# EAGLE design AUTOPILOT IO (EAGLE 7.7.0)
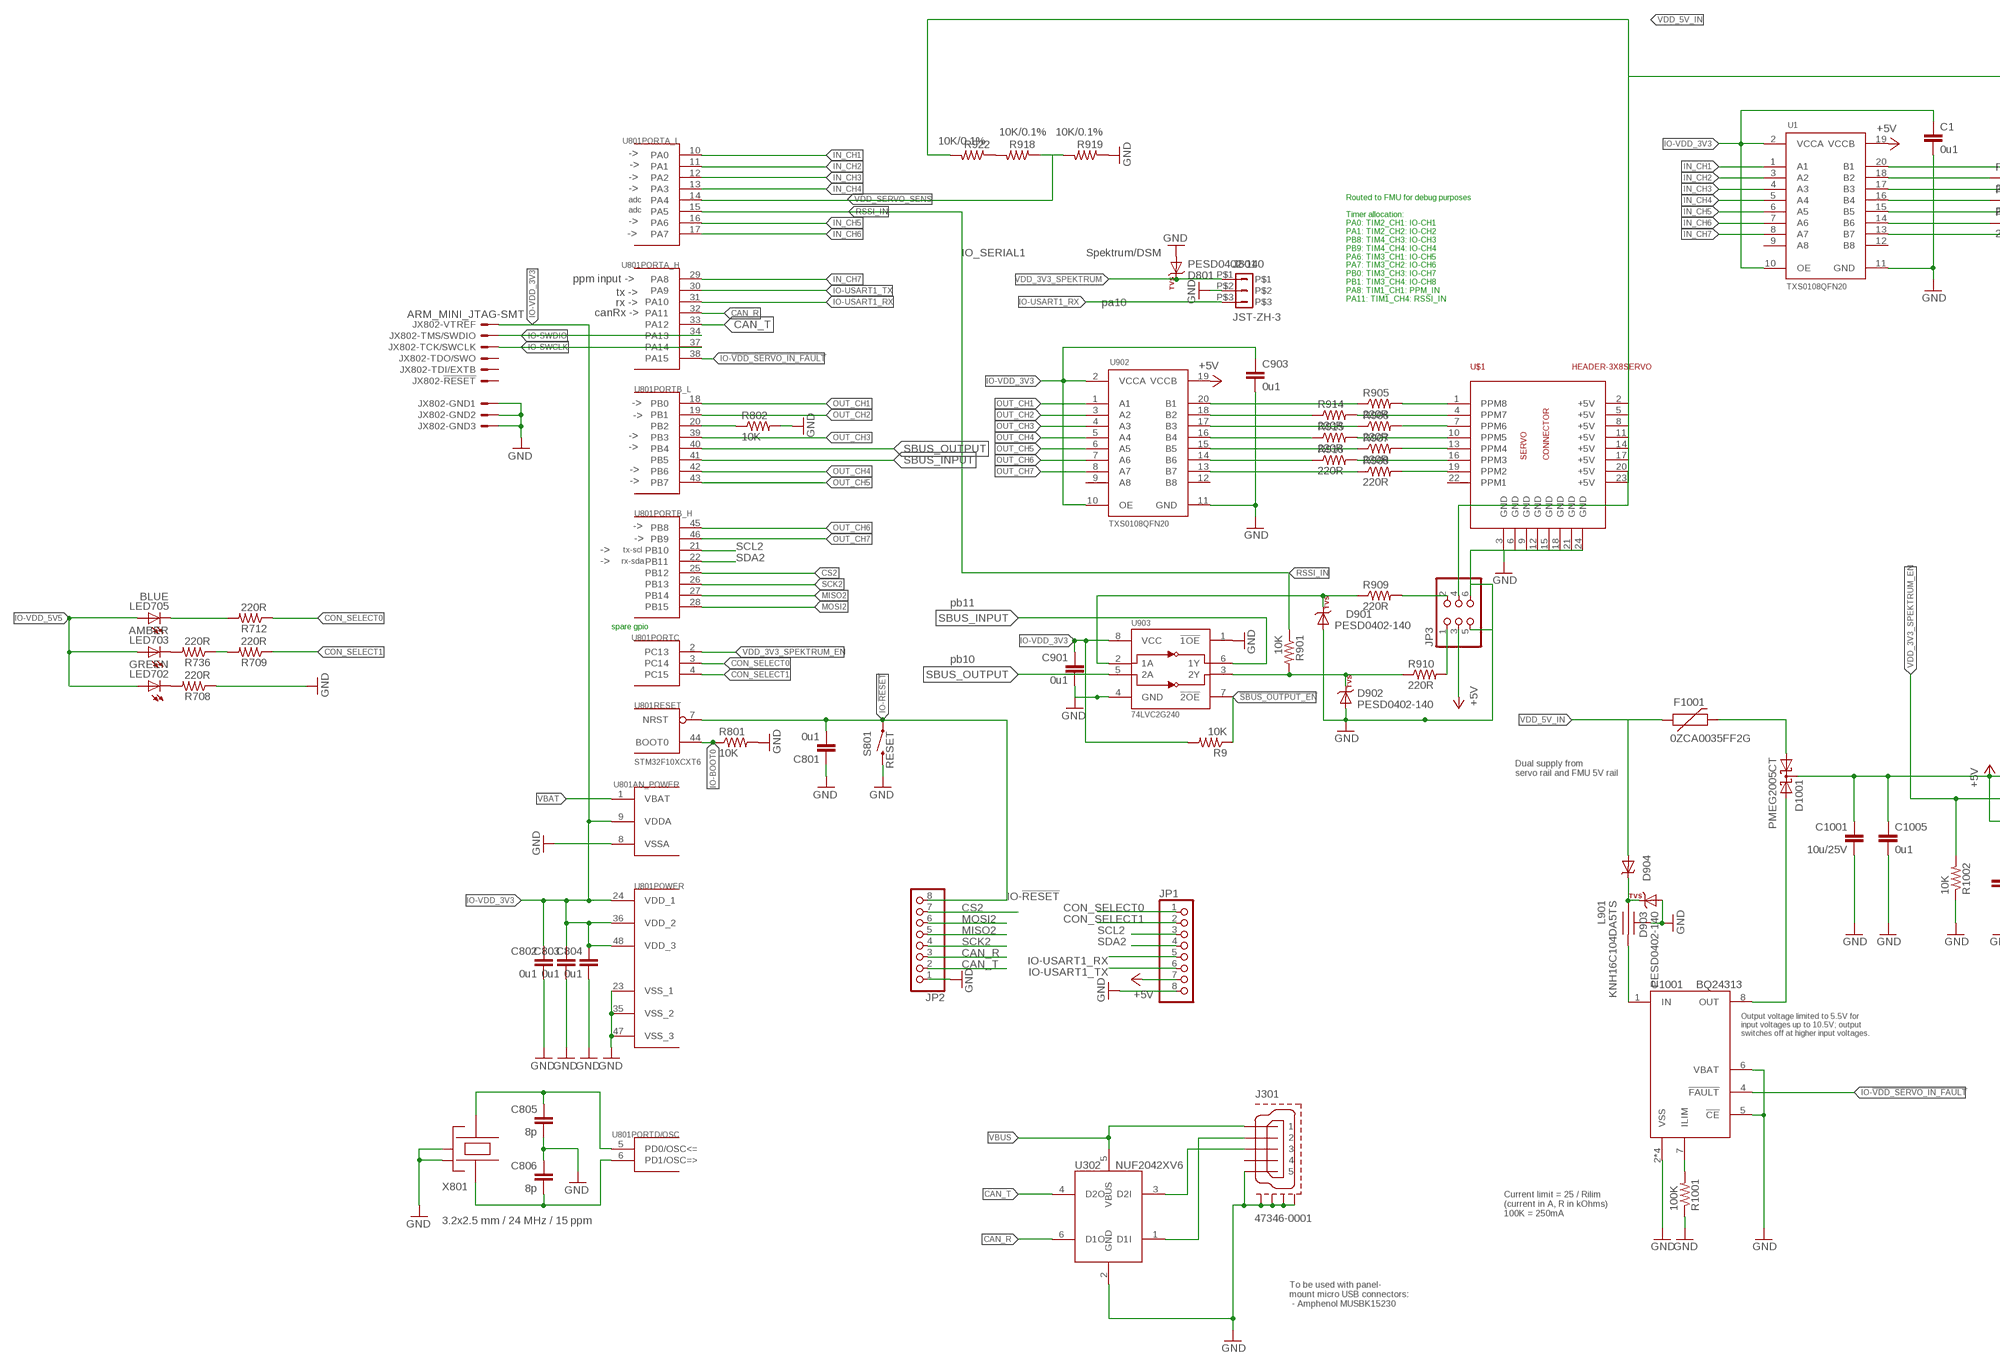
[diagram p0: schematic, sheet 1, part 1 of 2]
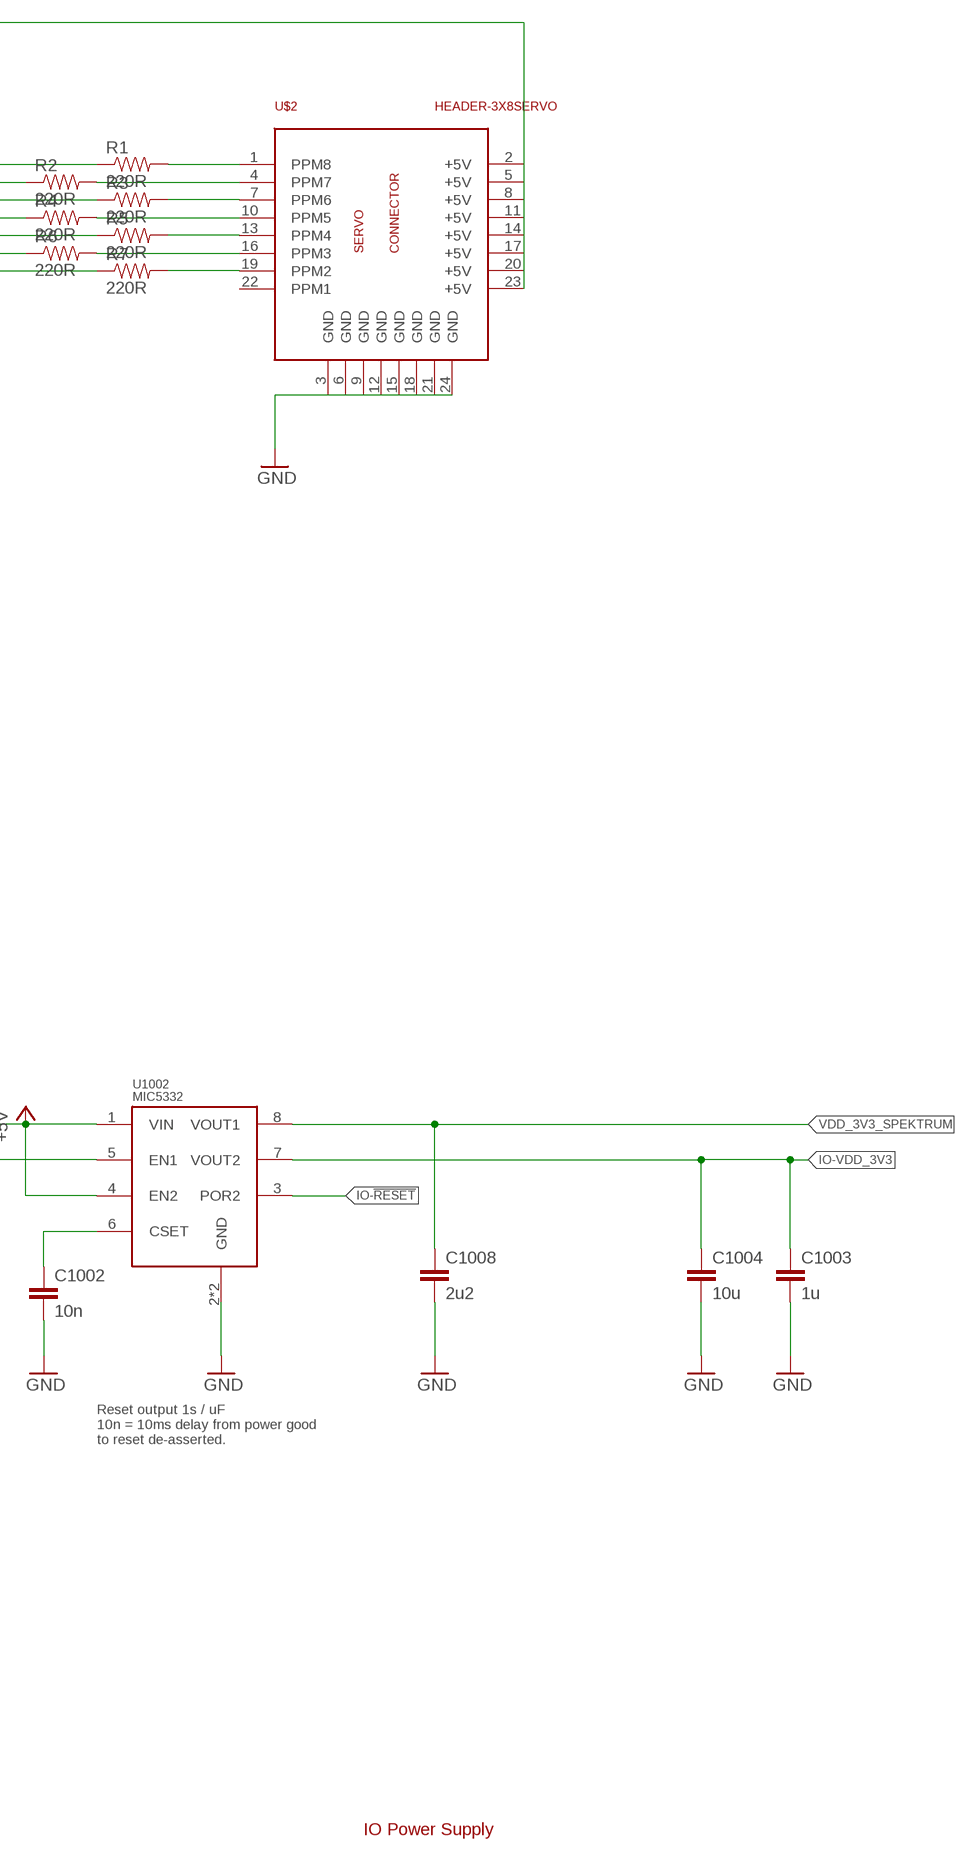
[diagram p1: schematic, sheet 1, part 2 of 2]

## Parts
C1  0u1  CAP0402  [0402-CAP]
C801  0u1  CAP0402  [0402-CAP]
C802  0u1  CAP0402  [0402-CAP]
C803  0u1  CAP0402  [0402-CAP]
C804  0u1  CAP0402  [0402-CAP]
C805  8p  CAP0402  [0402-CAP]
C806  8p  CAP0402  [0402-CAP]
C901  0u1  CAP0402  [0402-CAP]
C903  0u1  CAP0402  [0402-CAP]
C1001  10u/25V  CAP0805  [0805-CAP]
C1002  10n  CAP0402  [0402-CAP]
C1003  1u  CAP0603  [0603-CAP]
C1004  10u  CAP0603  [0603-CAP]
C1005  0u1  CAP0402  [0402-CAP]
C1008  2u2  CAP0402  [0402-CAP]
D801  PESD0402-140  DIODE-TVS  [0402-TVS]
D901  PESD0402-140  DIODE-TVS  [0402-TVS]
D902  PESD0402-140  DIODE-TVS  [0402-TVS]
D903  PESD0402-140  DIODE-TVS  [0402-TVS]
D904  MSS1P4-M3  DIODE-SCHOTTKY_MSMP  [MICROSMP]
D1001  PMEG2005CT  [SOT23-3]
F1001  0ZCA0035FF2G  PTCSMD  [PTC-1206]
J301  47346-0001  MOLEX-47346-0001  [MOLEX-47346-0001]
J801  JST-ZH-3  [JST-ZH-SMT-VERTICAL]
JP1  PINHD-1X8  [1X08]
JP2  PINHD-1X8  [1X08]
JP3  PINHD-2X3  [2X03]
JX802  ARM_MINI_JTAG-SMT  [FTSH-105-01-XXX-DV-K]
L901  KNH16C104DA5TS  [KYOCERA-KNH16-DA]
LED702  GREEN  LED0603  [0603-LED]
LED703  AMBER  LED0603  [0603-LED]
LED705  BLUE  LED0603  [0603-LED]
R1  220R  RESISTOR0402-RES  [0402-RES]
R2  220R  RESISTOR0402-RES  [0402-RES]
R3  220R  RESISTOR0402-RES  [0402-RES]
R4  220R  RESISTOR0402-RES  [0402-RES]
R5  220R  RESISTOR0402-RES  [0402-RES]
R6  220R  RESISTOR0402-RES  [0402-RES]
R7  220R  RESISTOR0402-RES  [0402-RES]
R9  10K  RESISTOR0402-RES  [0402-RES]
R708  220R  RESISTOR0402-RES  [0402-RES]
R709  220R  RESISTOR0402-RES  [0402-RES]
R712  220R  RESISTOR0402-RES  [0402-RES]
R736  220R  RESISTOR0402-RES  [0402-RES]
R801  10K  RESISTOR0402-RES  [0402-RES]
R802  10K  RESISTOR0402-RES  [0402-RES]
R901  10K  RESISTOR0402-RES  [0402-RES]
R905  220R  RESISTOR0402-RES  [0402-RES]
R906  220R  RESISTOR0402-RES  [0402-RES]
R907  220R  RESISTOR0402-RES  [0402-RES]
R908  220R  RESISTOR0402-RES  [0402-RES]
R909  220R  RESISTOR0402-RES  [0402-RES]
R910  220R  RESISTOR0402-RES  [0402-RES]
R914  220R  RESISTOR0402-RES  [0402-RES]
R915  220R  RESISTOR0402-RES  [0402-RES]
R916  220R  RESISTOR0402-RES  [0402-RES]
R918  10K/0.1%  RESISTOR0402-RES  [0402-RES]
R919  10K/0.1%  RESISTOR0402-RES  [0402-RES]
R922  10K/0.1%  RESISTOR0402-RES  [0402-RES]
R1001  100K  RESISTOR0402-RES  [0402-RES]
R1002  10K  RESISTOR0402-RES  [0402-RES]
S801  RESET  SWITCH-MOMENTARY-2  [EVQP7J01K]
U1  TXS0108QFN20  [QFN20-RGY]
U302  NUF2042XV6  [SOT563-6]
U801  STM32F10XCXT6  [TQFP48]
U902  TXS0108QFN20  [QFN20-RGY]
U903  74LVC2G240  74LVC2G240-TSSOP-8  [TSSOP8_SOT505-2]
U1001  BQ24313  [QFN8-DSG]
U1002  MIC5332  [MLF-8-EPAD]
U$1  HEADER-3X8SERVO  [3X8RA]
U$2  HEADER-3X8SERVO  [3X8RA]
X801  3.2x2.5 mm / 24 MHz / 15 ppm  OSCILLATOR-3.2X2.5  [OSCILLATOR-3.2X2.5]

## Nets
!SBUS_OUTPUT_EN: R9.P$1 U903.7(!2OE)
+5V: C1001.P$1 C1005.P$1 D1001.3(CC) JP1.7 JP3.3 U1.19(VCCB) U902.19(VCCB) U1002.1(VIN) U1002.4(EN2)
CAN_R: JP2.3 U302.6(D1O) U801.32(PORTA_H:PA11)
CAN_T: JP2.2 U302.4(D2O) U801.33(PORTA_H:PA12)
CON_SELECT0: JP1.1 R712.P$1 U801.3(PORTC:PC14)
CON_SELECT1: JP1.2 R709.P$1 U801.4(PORTC:PC15)
CS2: JP2.7 U801.25(PORTB_H:PB12)
GND [power]: C1.P$2 C801.P$1 C802.P$2 C803.P$2 C804.P$2 C805.P$2 C806.P$1 C901.P$2 C903.P$2 C1001.P$2 C1002.P$2 C1003.P$2 C1004.P$2 C1005.P$2 C1008.P$2 D801.A D901.A D902.A D903.A J301.GND J301.GND1 J301.GND2 J301.GND3 J301.GND4 J801.P$2 JP1.8 JP2.1 JP3.5 JP3.6 JX802.3 JX802.5 JX802.9 L901.P$3 L901.P$4 L901.P$5 R708.P$1 R801.P$2 R802.P$2 R919.P$1 R1001.P$1 R1002.P$1 S801.B3 U1.11(GND) U302.2(GND) U801.8(AN_POWER:VSSA) U801.23(POWER:VSS_1) U801.35(POWER:VSS_2) U801.47(POWER:VSS_3) U902.11(GND) U903.1(!1OE) U903.4(GND) U1001.2(VSS) U1001.5(!CE) U1001.6(VBAT) U1001.GND(VSS) U1001.P$2(VSS) U1001.P$3(VSS) U1002.2(GND) U1002.GND U$1.3(GND) U$1.6(GND) U$1.9(GND) U$1.12(GND) U$1.15(GND) U$1.18(GND) U$1.21(GND) U$1.24(GND) U$2.3(GND) U$2.6(GND) U$2.9(GND) U$2.12(GND) U$2.15(GND) U$2.18(GND) U$2.21(GND) U$2.24(GND) X801.2(NC_2) X801.4(NC_4)
IN_CH1: U1.1(A1) U801.10(PORTA_L:PA0)
IN_CH2: U1.3(A2) U801.11(PORTA_L:PA1)
IN_CH3: U1.4(A3) U801.12(PORTA_L:PA2)
IN_CH4: U1.5(A4) U801.13(PORTA_L:PA3)
IN_CH5: U1.6(A5) U801.16(PORTA_L:PA6)
IN_CH6: U1.7(A6) U801.17(PORTA_L:PA7)
IN_CH7: D901.C R909.P$1 U1.8(A7) U801.29(PORTA_H:PA8) U903.2(1A)
IO-!RESET: C801.P$2 JP2.8 S801.A1 U801.7(RESET:NRST) U1002.3(POR2)
IO-!VDD_SERVO_IN_FAULT: U801.38(PORTA_H:PA15) U1001.4(!FAULT)
IO-BOOT0: R801.P$1 U801.44(RESET:BOOT0)
IO-BOOT1: R802.P$1 U801.20(PORTB_L:PB2)
IO-CH8-PROT: R905.P$2 U$1.1(PPM8)
IO-CH8-PROT1: R1.P$2 U$2.1(PPM8)
IO-SWCLK: JX802.4 U801.37(PORTA_H:PA14)
IO-SWDIO: JX802.2 U801.34(PORTA_H:PA13)
IO-USART1_RX: J801.P$3 JP1.5 U801.31(PORTA_H:PA10)
IO-USART1_TX: JP1.6 U801.30(PORTA_H:PA9)
IO-VDD_3V3 [power]: C1.P$1 C802.P$1 C803.P$1 C804.P$1 C901.P$1 C903.P$1 C1003.P$1 C1004.P$1 JX802.1 R9.P$2 U1.2(VCCA) U1.10(OE) U801.9(AN_POWER:VDDA) U801.24(POWER:VDD_1) U801.36(POWER:VDD_2) U801.48(POWER:VDD_3) U902.2(VCCA) U902.10(OE) U903.8(VCC) U1002.7(VOUT2)
IO-VDD_5V5 [power]: LED702.A LED703.A LED705.A
MISO2: JP2.5 U801.27(PORTB_H:PB14)
MOSI2: JP2.6 U801.28(PORTB_H:PB15)
N$1 [power]: D1001.2(A2) U1001.8(OUT)
N$2: R1.P$1 U1.20(B1)
N$3: R918.P$2 R922.P$1
N$4: R2.P$1 U1.18(B2)
N$5: R3.P$1 U1.17(B3)
N$6: R4.P$1 U1.16(B4)
N$7: R5.P$1 U1.15(B5)
N$8: R6.P$1 U1.14(B6)
N$9: LED705.C R712.P$2
N$10: R7.P$1 U1.13(B7)
N$12: R3.P$2 U$2.7(PPM6)
N$13: R4.P$2 U$2.10(PPM5)
N$14: R5.P$2 U$2.13(PPM4)
N$15: R6.P$2 U$2.16(PPM3)
N$16: R7.P$2 U$2.19(PPM2)
N$17: R2.P$2 U$2.4(PPM7)
N$18: C806.P$2 U801.6(PORTD/OSC:PD1/OSC=>) X801.1
N$19: L901.P$2 U1001.1(IN)
N$20: R1001.P$2 U1001.7(ILIM)
N$22: C805.P$1 U801.5(PORTD/OSC:PD0/OSC<=) X801.3
N$29: LED702.C R708.P$2
N$31: R914.P$2 U$1.4(PPM7)
N$38: D902.C R901.P$2 R910.P$1 U903.3(2Y)
N$39: R709.P$2 R736.P$1
N$40: LED703.C R736.P$2
N$43: R905.P$1 U902.20(B1)
N$44: R914.P$1 U902.18(B2)
N$45: R906.P$1 U902.17(B3)
N$46: D1001.1(A1) F1001.2
N$49: R915.P$1 U902.16(B4)
N$53: R907.P$1 U902.15(B5)
N$58: R916.P$1 U902.14(B6)
N$59: R908.P$1 U902.13(B7)
N$71: R906.P$2 U$1.7(PPM6)
N$72: R915.P$2 U$1.10(PPM5)
N$73: R907.P$2 U$1.13(PPM4)
N$74: R916.P$2 U$1.16(PPM3)
N$75: R908.P$2 U$1.19(PPM2)
N$99: JP3.1 R910.P$2
N$104: C1002.P$1 U1002.6(CSET)
N$110 [power]: D903.C D904.CATHODE(C) L901.P$1
OTG_DM1: J301.D- U302.1(D1I)
OTG_DP1: J301.D+ U302.3(D2I)
OUT_CH1: U801.18(PORTB_L:PB0) U902.1(A1)
OUT_CH2: U801.19(PORTB_L:PB1) U902.3(A2)
OUT_CH3: U801.39(PORTB_L:PB3) U902.4(A3)
OUT_CH4: U801.42(PORTB_L:PB6) U902.5(A4)
OUT_CH5: U801.43(PORTB_L:PB7) U902.6(A5)
OUT_CH6: U801.45(PORTB_H:PB8) U902.7(A6)
OUT_CH7: U801.46(PORTB_H:PB9) U902.8(A7)
PPM-SBUS-PROT: JP3.2 R909.P$2
RSSI_IN: R901.P$1 U801.15(PORTA_L:PA5)
SBUS_INPUT: U801.41(PORTB_L:PB5) U903.6(1Y)
SBUS_OUTPUT: U801.40(PORTB_L:PB4) U903.5(2A)
SCK2: JP2.4 U801.26(PORTB_H:PB13)
SCL2: JP1.3 U801.21(PORTB_H:PB10)
SDA2: JP1.4 U801.22(PORTB_H:PB11)
VBAT: U801.1(AN_POWER:VBAT)
VBUS [power]: J301.VBUS U302.5(VBUS)
VDD_3V3_SPEKTRUM [power]: C1008.P$1 D801.C J801.P$1 U1002.8(VOUT1)
VDD_3V3_SPEKTRUM_EN: R1002.P$2 U801.2(PORTC:PC13) U1002.5(EN1)
VDD_5V_IN [power]: D904.ANODE(A) F1001.1 JP3.4 R922.P$2 U$1.2(+5V) U$1.5(+5V) U$1.8(+5V) U$1.11(+5V) U$1.14(+5V) U$1.17(+5V) U$1.20(+5V) U$1.23(+5V) U$2.2(+5V) U$2.5(+5V) U$2.8(+5V) U$2.11(+5V) U$2.14(+5V) U$2.17(+5V) U$2.20(+5V) U$2.23(+5V)
VDD_SERVO_SENS: R918.P$1 R919.P$2 U801.14(PORTA_L:PA4)
Unconnected: J301.ID JX802.6 JX802.8 JX802.10 U1.9(A8) U1.12(B8) U902.9(A8) U902.12(B8) U$1.22(PPM1) U$2.22(PPM1)

## Notes on the sheet
- ->
- ->
- ->
- ->
- Routed to FMU for debug purposes
- adc
- adc
- ->
- ->
- IO_SERIAL1 | Spektrum/DSM
- ppm input ->
- tx ->
- Timer allocation:
  PA0: TIM2_CH1: IO-CH1
  PA1: TIM2_CH2: IO-CH2
  PB8: TIM4_CH3: IO-CH3
  PB9: TIM4_CH4: IO-CH4
  PA6: TIM3_CH1: IO-CH5
  PA7: TIM3_CH2: IO-CH6
  PB0: TIM3_CH3: IO-CH7
  PB1: TIM3_CH4: IO-CH8
  PA8: TIM1_CH1: PPM_IN
  PA11: TIM1_CH4: RSSI_IN
- rx -> | pa10
- canRx ->
- ->
- ->
- ->
- ->
- ->
- ->
- ->
- ->
- -> | tx-scl
- -> | rx-sda
- pb11
- spare gpio
- pb10
- Dual supply from
  servo rail and FMU 5V rail
- Reset output 1s / uF
  10n = 10ms delay from power good
  to reset de-asserted.
- Output voltage limited to 5.5V for
  input voltages up to 10.5V; output
  switches off at higher input voltages.
- Current limit = 25 / Rilim
  (current in A, R in kOhms)
  100K = 250mA
- IO Power Supply
- To be used with panel-
  mount micro USB connectors:
   - Amphenol MUSBK15230

## Library data of the parts
C1 C801-C804 C901 C903 C1005 = pixhawk2:CAP: Capacitor Standard 0603 ceramic capacitor, and 0.1" leaded capacitor.; PARTNO: CC0402ZRY5V7BB104
C805 C806 = pixhawk2:CAP: Capacitor Standard 0603 ceramic capacitor, and 0.1" leaded capacitor.; PARTNO: C1005C0G1H080C
C1001 = pixhawk2:CAP: Capacitor Standard 0603 ceramic capacitor, and 0.1" leaded capacitor.; PARTNO: CL21A106KAYNNNE
C1002 = pixhawk2:CAP: Capacitor Standard 0603 ceramic capacitor, and 0.1" leaded capacitor.; PARTNO: CC0402KRX7R7BB103
C1003 = pixhawk2:CAP: Capacitor Standard 0603 ceramic capacitor, and 0.1" leaded capacitor.; PARTNO: CC0603ZRY5V7BB105
C1004 = pixhawk2:CAP: Capacitor Standard 0603 ceramic capacitor, and 0.1" leaded capacitor.; PARTNO: C1608X5R1A106K080AC
C1008 = pixhawk2:CAP: Capacitor Standard 0603 ceramic capacitor, and 0.1" leaded capacitor.; PARTNO: C1005X6S1C225K050BC
D801 D901-D903 = pixhawk2:DIODE-TVS; PARTNO: PESD0402-140
D904 = pixhawk2:DIODE-SCHOTTKY: Schottky barrier diode in DO214AC, e.g. Fairchild SS14.; PARTNO: MSS1P4-M3/89A
D1001 = pixhawk2:PMEG2005CT: 500 mA low VF dual MEGA Schottky barrier rectifier http://www.nxp.com/documents/data_sheet/PMEG2005CT.pdf; PARTNO: PMEG2005CT
F1001 = pixhawk2:PTC: Resettable Fuse PTC Resettable Fuse. Spark Fun Electronics SKU : COM-08357; PARTNO: 0ZCA0035FF2G
J301 = pixhawk2:MOLEX-47346-0001: MICRO USB B, BOTTOM MOUNT; PARTNO: 47346-0001
J801 = for-transfers:JST-ZH-3; PARTNO: B3B-ZR-SM4-TF (LF)(SN)(P)
JP1 JP2 = pinhead2:PINHD-1X8: PIN HEADER
JP3 = pinhead2:PINHD-2X3: PIN HEADER
JX802 = pixhawk2:ARM_MINI_JTAG: CONNECTOR wire to board 1.25 mm (.049 inch) pitch header; BOM: EXCLUDE; PARTNO: M50-3900542
L901 = pixhawk2:KNH16C104DA5TS: Kyocera KNH16C104DA5TS EMI filter; PARTNO: KNH16C104DA5TS
LED702 = pixhawk2:LED: LEDs Standard schematic elements and footprints for 5mm, 3mm, 1206, and 0603 sized LEDs. 5mm - Spark Fun Electronics SKU : COM-00529 (and others); PARTNO: APTD1608CGCK
LED703 = pixhawk2:LED: LEDs Standard schematic elements and footprints for 5mm, 3mm, 1206, and 0603 sized LEDs. 5mm - Spark Fun Electronics SKU : COM-00529 (and others); PARTNO: APTD1608SECK
LED705 = pixhawk2:LED: LEDs Standard schematic elements and footprints for 5mm, 3mm, 1206, and 0603 sized LEDs. 5mm - Spark Fun Electronics SKU : COM-00529 (and others); PARTNO: APTD1608QBC/D
R1-R7 R708 R709 R712 R736 R905-R910 R914-R916 = pixhawk2:RESISTOR: Resistor Basic schematic elements and footprints for 0603, 1206, and PTH 1/10th watt (small) resistors.; PARTNO: RC0402FR-07220RL
R9 R801 R802 R901 R1002 = pixhawk2:RESISTOR: Resistor Basic schematic elements and footprints for 0603, 1206, and PTH 1/10th watt (small) resistors.; PARTNO: RC0402FR-0710KL
R918 R919 R922 = pixhawk2:RESISTOR: Resistor Basic schematic elements and footprints for 0603, 1206, and PTH 1/10th watt (small) resistors.; PARTNO: ERA-2AEB103X
R1001 = pixhawk2:RESISTOR: Resistor Basic schematic elements and footprints for 0603, 1206, and PTH 1/10th watt (small) resistors.; PARTNO: RC0402FR-07100KL
S801 = pixhawk2:SWITCH-MOMENTARY-2; PARTNO: EVQ-P7J01P
U1 U902 = pixhawk2:TXS0108; PARTNO: TXS0108ERGYR
U302 = pixhawk2:NUF2042XV6; PARTNO: NUF2042XV6T1G
U801 = pixhawk2:STM32F10XCXT6: ST STM32F101/103 48pin LQFP; PARTNO: STM32F100C8T6B
U903 = pixhawk2:74LVC2G240: Dual inverter tri-state, 3.3V/5V compatible http://www.nxp.com/documents/data_sheet/74LVC2G240.pdf http://focus.ti.com/lit/ds/symlink/sn74lvc2g240.pdf; PARTNO: 74LVC2G240DP,125
U1001 = pixhawk2:BQ24313; PARTNO: BQ24313DSGT
U1002 = pixhawk2:MIC5332; PARTNO: MIC5332-SSYMT
U$1 U$2 = pixhawk2:HEADER-3X8
X801 = pixhawk2:OSCILLATOR: Crystal Oscillator in 3.2x2.5 SMD; PARTNO: NX3225SA-24.000000MHZ

## Net classes
0 signal: width 0.15 mm, drill 0.15 mm, clearance 0.152 mm
1 power: width 0.15 mm, drill 0.2 mm, clearance 0.152 mm

## Board
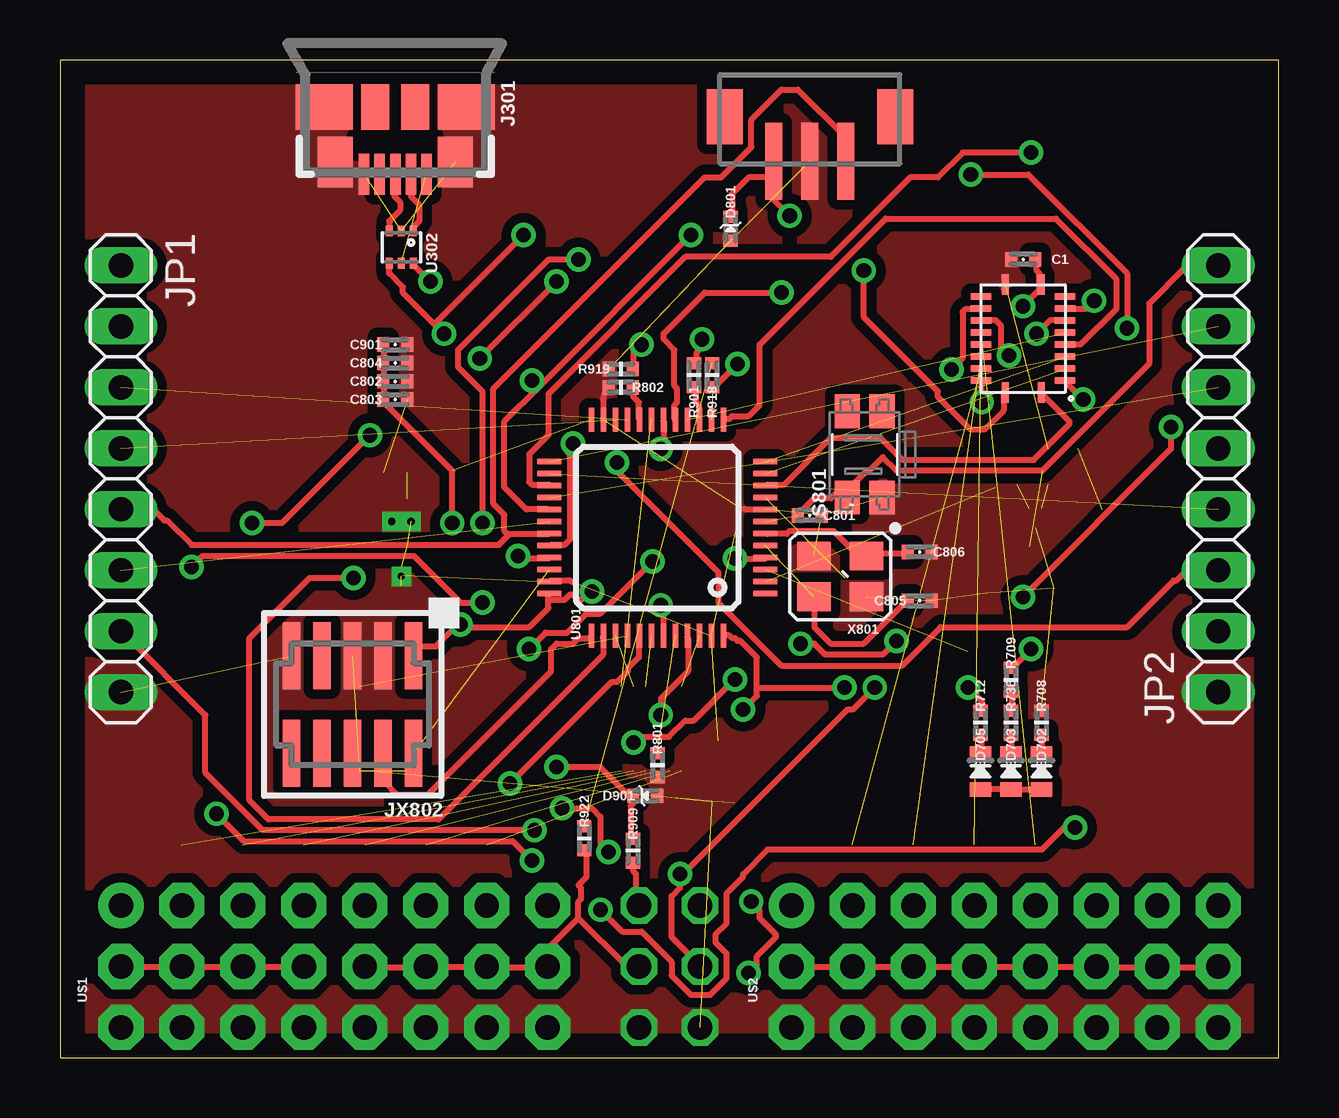
[diagram p2: board, top side]
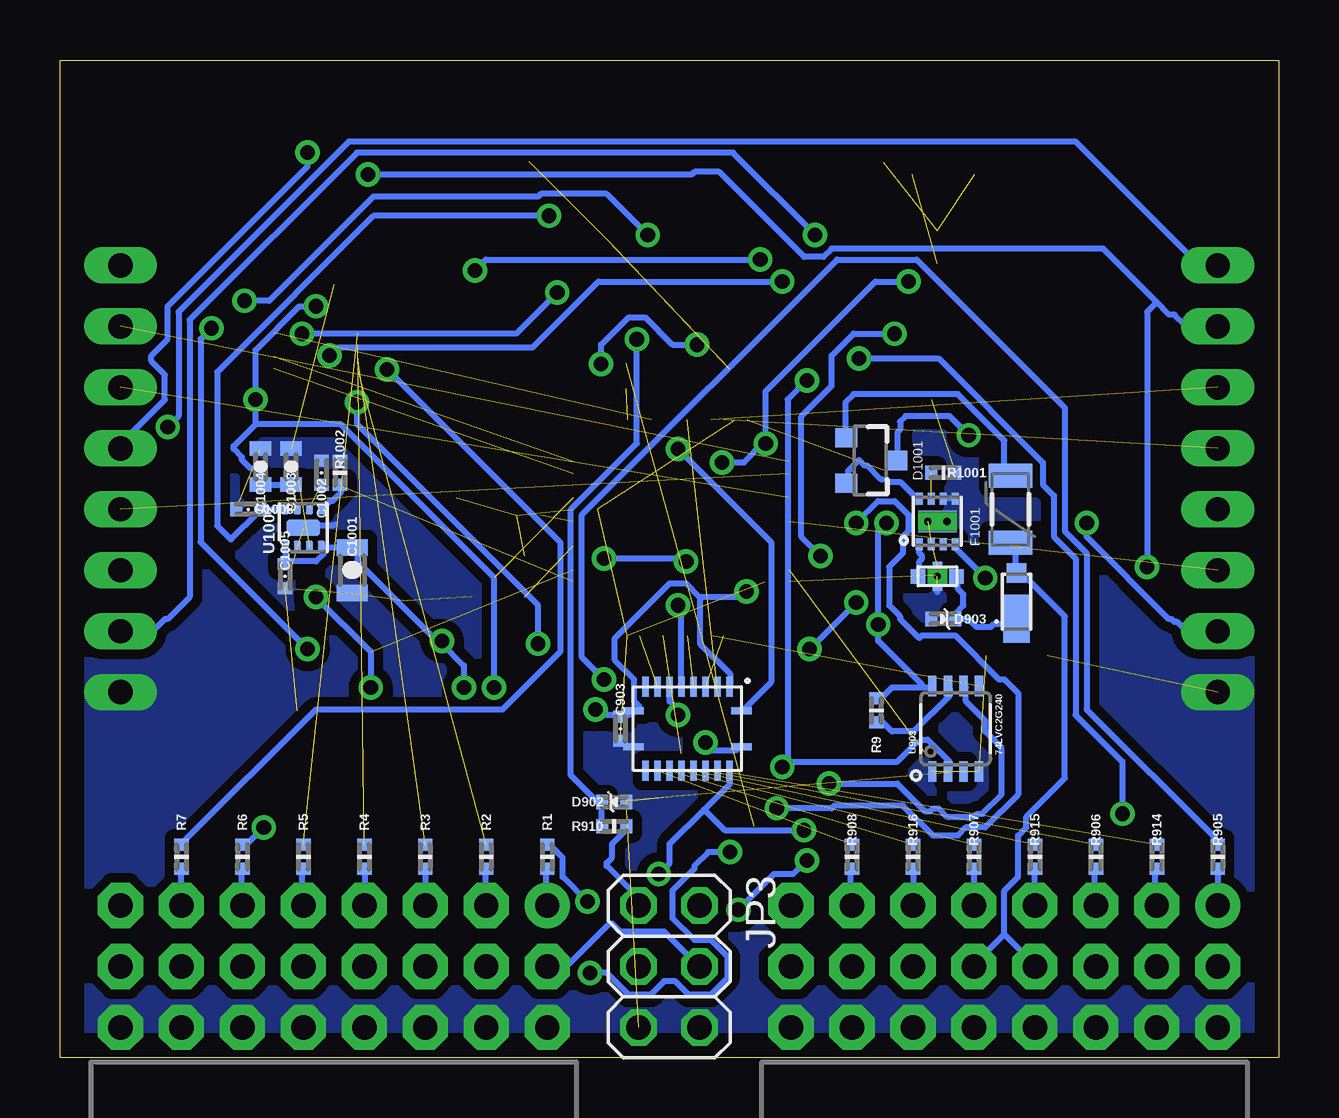
[diagram p3: board, bottom side, seen from below]

Size 50.78 x 41.58 mm. Coordinates in mm from the lower left corner, seen from the top.
Outline: 0,0 50.78,0 50.78,41.58 0,41.58 0,0
Copper layers (1*16): Top 0.035mm / dielectric 1.5mm / Bottom 0.035mm
Design rules "default": minimum track width 10mil, minimum drill 24mil, track to track 8mil, track to pad 8mil, pad to pad 8mil, via to via 8mil, smd to smd 8mil, copper to edge 40mil, drill to drill 8mil, minimum pad ring 10mil, minimum via ring 8mil, stop-mask expansion 4mil, vias tented up to drill 0mil, thermal gap 10mil

### Footprints (pad centres in the part's own frame; a part is rotated, then mirrored left to right if it is on the bottom)
0402-CAP = smd 0.5 x 0.6: P$1 -0.5,0; P$2 0.5,0
0805-CAP = smd 0.7 x 1.3: P$1 -0.95,0; P$2 0.95,0
0603-CAP = smd 0.6 x 0.9: P$1 -0.75,0; P$2 0.75,0
0402-TVS = smd 0.5 x 0.6: A 0.5,0; C -0.5,0
MICROSMP = smd 0.8 x 0.8: ANODE 0.65,0 | smd 2 x 1.1: CATHODE -1.25,0
SOT23-3 = smd 0.8 x 0.9: 1 -0.95,-1; 2 0.95,-1; 3 0,1.1
PTC-1206 = smd 1 x 1.8: 1 -1.4,0; 2 1.4,0
MOLEX-47346-0001 = smd 1.7 x 0.44: D+ 2.8,0; D- 2.8,0.65; GND 2.8,-1.3; ID 2.8,-0.65; VBUS 2.8,1.3 | smd 1.9 x 2.375: GND1 0,2.95; GND4 0,-2.95 | smd 2.1 x 1.475: GND2 2.3,2.5; GND3 2.3,-2.5 | smd 1.9 x 1.175: GND5 0,-0.838; GND6 0,0.838
JST-ZH-SMT-VERTICAL = smd 0.7 x 3.2: P$1 -1.5,-1.75; P$2 0,-1.75; P$3 1.5,-1.75 | smd 1.5 x 2.3: P$4 3.55,0.1; P$5 -3.55,0.1
1X08 = drill 1.016 long: 1 -8.89,0; 2 -6.35,0; 3 -3.81,0; 4 -1.27,0; 5 1.27,0; 6 3.81,0; 7 6.35,0; 8 8.89,0
2X03 = drill 1.016 octagon: 1 -2.54,-1.27; 2 -2.54,1.27; 3 0,-1.27; 4 0,1.27; 5 2.54,-1.27; 6 2.54,1.27
FTSH-105-01-XXX-DV-K = smd 0.737 x 2.794: 1 -2.54,-2.032; 2 -2.54,2.032; 3 -1.27,-2.032; 4 -1.27,2.032; 5 0,-2.032; 6 0,2.032; 7 1.27,-2.032; 8 1.27,2.032; 9 2.54,-2.032; 10 2.54,2.032
KYOCERA-KNH16-DA = smd 0.6 x 0.6: P$1 -0.8,0; P$2 0.8,0 | smd 0.4 x 0.4: P$3 0,-0.4; P$4 0,0.4 | drill 0.3 pad 0.4 square: P$5 0,0
0603-LED = smd 0.6 x 0.9: A 0.75,0; C -0.75,0
0402-RES = smd 0.5 x 0.6: P$1 -0.5,0; P$2 0.5,0
EVQP7J01K = smd 1.4 x 1.05: A1 -1.8,0.725; A2 1.8,0.725; B3 -1.8,-0.725; B4 1.8,-0.725
QFN20-RGY = smd 0.28 x 0.85: 1 -0.75,2.25; 10 -0.75,-2.25; 11 0.75,-2.25; 20 0.75,2.25 | smd 0.85 x 0.28: 2 -1.75,1.75; 3 -1.75,1.25; 4 -1.75,0.75; 5 -1.75,0.25; 6 -1.75,-0.25; 7 -1.75,-0.75; 8 -1.75,-1.25; 9 -1.75,-1.75; 12 1.75,-1.75; 13 1.75,-1.25; 14 1.75,-0.75; 15 1.75,-0.25; 16 1.75,0.25; 17 1.75,0.75; 18 1.75,1.25; 19 1.75,1.75
SOT563-6 = smd 0.3 x 0.45: 1 -0.5,-0.675; 2 0,-0.675; 3 0.5,-0.675; 4 0.5,0.675; 5 0,0.675; 6 -0.5,0.675
TQFP48 = smd 0.24 x 1: 1 -2.75,-4.5; 2 -2.25,-4.5; 3 -1.75,-4.5; 4 -1.25,-4.5; 5 -0.75,-4.5; 6 -0.25,-4.5; 7 0.25,-4.5; 8 0.75,-4.5; 9 1.25,-4.5; 10 1.75,-4.5; 11 2.25,-4.5; 12 2.75,-4.5; 25 2.75,4.5; 26 2.25,4.5; 27 1.75,4.5; 28 1.25,4.5; 29 0.75,4.5; 30 0.25,4.5; 31 -0.25,4.5; 32 -0.75,4.5; 33 -1.25,4.5; 34 -1.75,4.5; 35 -2.25,4.5; 36 -2.75,4.5 | smd 1 x 0.24: 13 4.5,-2.75; 14 4.5,-2.25; 15 4.5,-1.75; 16 4.5,-1.25; 17 4.5,-0.75; 18 4.5,-0.25; 19 4.5,0.25; 20 4.5,0.75; 21 4.5,1.25; 22 4.5,1.75; 23 4.5,2.25; 24 4.5,2.75; 37 -4.5,2.75; 38 -4.5,2.25; 39 -4.5,1.75; 40 -4.5,1.25; 41 -4.5,0.75; 42 -4.5,0.25; 43 -4.5,-0.25; 44 -4.5,-0.75; 45 -4.5,-1.25; 46 -4.5,-1.75; 47 -4.5,-2.25; 48 -4.5,-2.75
TSSOP8_SOT505-2 = smd 0.35 x 0.85: 1 -0.975,-1.775; 2 -0.325,-1.775; 3 0.325,-1.775; 4 0.975,-1.775; 5 0.975,1.775; 6 0.325,1.775; 7 -0.325,1.775; 8 -0.975,1.775
QFN8-DSG = smd 0.28 x 0.5: 1 -0.75,-0.95; 2 -0.25,-0.95; 3 0.25,-0.95; 4 0.75,-0.95; 5 0.75,0.95; 6 0.25,0.95; 7 -0.25,0.95; 8 -0.75,0.95 | smd 1.6 x 0.9: GND 0,0 | drill 0.3 square: P$2 -0.4,0; P$3 0.4,0
MLF-8-EPAD = smd 0.5 x 0.3: 1 -0.8,0.75; 2 -0.8,0.25; 3 -0.8,-0.25; 4 -0.8,-0.75; 5 0.8,-0.75; 6 0.8,-0.25; 7 0.8,0.25; 8 0.8,0.75 | smd 0.7 x 1.4: GND 0,0
3X8RA = drill 1.016 pad 1.88: 1 3.81,8.89 | drill 1.016 pad 1.88 octagon: 2 1.27,8.89; 3 -1.27,8.89; 4 3.81,6.35; 5 1.27,6.35; 6 -1.27,6.35; 7 3.81,3.81; 8 1.27,3.81; 9 -1.27,3.81; 10 3.81,1.27; 11 1.27,1.27; 12 -1.27,1.27; 13 3.81,-1.27; 14 1.27,-1.27; 15 -1.27,-1.27; 16 3.81,-3.81; 17 1.27,-3.81; 18 -1.27,-3.81; 19 3.81,-6.35; 20 1.27,-6.35; 21 -1.27,-6.35; 22 3.81,-8.89; 23 1.27,-8.89; 24 -1.27,-8.89
OSCILLATOR-3.2X2.5 = smd 1.4 x 1.2: 1 -1.1,-0.85; 2 1.1,-0.85; 3 1.1,0.85; 4 -1.1,0.85

### Placement (x,y rotation side)
C1  40.13,33.27 180 top
C801  31.24,22.61 180 top
C802  13.97,28.19 0 top
C803  13.97,27.43 0 top
C804  13.97,28.96 0 top
C805  35.81,19.05 0 top
C806  35.81,21.08 180 top
C901  13.97,29.72 0 top
C903  27.43,13.72 270 bottom
C1001  38.61,20.32 270 bottom
C1002  39.88,24.38 90 bottom
C1003  41.15,24.64 90 bottom
C1004  42.42,24.64 90 bottom
C1005  41.4,20.07 270 bottom
C1008  42.93,22.86 180 bottom
D801  27.94,34.54 270 top
D901  24.38,10.92 0 top
D902  27.69,10.67 0 bottom
D903  13.97,18.29 180 bottom
D904  10.92,19.56 90 bottom
D1001  17.02,24.89 270 bottom
F1001  11.18,22.86 90 bottom
J301  13.97,39.62 270 top
J801  31.24,39.12 0 top
JP1  2.54,24.13 270 top
JP2  48.26,24.13 90 top
JP3  25.4,3.81 270 bottom
JX802  12.19,14.73 180 top
L901  14.22,20.07 180 bottom
LED702  40.89,11.94 270 top
LED703  39.62,11.94 270 top
LED705  38.35,11.94 270 top
R1  30.48,8.38 270 bottom
R2  33.02,8.38 270 bottom
R3  35.56,8.38 270 bottom
R4  38.1,8.38 270 bottom
R5  40.64,8.38 270 bottom
R6  43.18,8.38 270 bottom
R7  45.72,8.38 270 bottom
R9  16.76,14.48 90 bottom
R708  40.89,13.97 270 top
R709  39.62,15.75 270 top
R712  38.35,13.97 270 top
R736  39.62,13.97 270 top
R801  24.89,12.19 270 top
R802  23.37,27.94 180 top
R901  26.42,28.45 90 top
R905  2.54,8.38 270 bottom
R906  7.62,8.38 270 bottom
R907  12.7,8.38 270 bottom
R908  17.78,8.38 270 bottom
R909  23.88,8.64 270 top
R910  27.69,9.65 0 bottom
R914  5.08,8.38 270 bottom
R915  10.16,8.38 270 bottom
R916  15.24,8.38 270 bottom
R918  27.18,28.45 90 top
R919  23.37,28.7 0 top
R922  21.84,9.14 270 top
R1001  13.97,24.38 180 bottom
R1002  39.12,24.38 270 bottom
S801  33.53,25.15 90 top
U1  40.13,29.97 180 top
U302  14.22,33.78 180 top
U801  24.89,22.1 90 top
U902  24.64,13.72 270 bottom
U903  13.46,13.72 0 bottom
U1001  14.22,22.35 0 bottom
U1002  40.64,22.1 90 bottom
U$1  11.43,2.54 90 top
U$2  39.37,2.54 90 top
X801  32.51,20.07 180 top

### Tracks (layer width: path | path; a pad name or v marks a point on that pad's centre or on a via)
!SBUS_OUTPUT_EN
  Bottom 0.254: R9.P$1 16.69,13.95 16.46,13.95 16.12,13.6 15.2,13.6 13.72,15.09 13.72,15.43 U903.7
+5V  (via drill 0.61)
  Top 0.254: v12.92,25.95 9.26,22.29 v8,22.29 | JP3.3 26.63,3.89 25.49,5.03 25.49,6.74 25.83,7.09 v25.83,7.66 25.95,7.66 32.8,14.52 33.03,14.52 v33.95,15.43 | v38.41,27.32 38.41,28.12 U1.19 | v30.86,17.26 31.43,17.26 31.89,16.8 34.29,16.8 v34.86,17.37 | v19.77,9.49 8.46,9.49 6.06,11.89 6.06,14.29 2.63,17.72 JP1.7
  Bottom 0.254: v12.92,25.95 13.72,26.75 15.54,26.75 15.77,26.52 15.77,26.18 15.89,26.06 15.89,24.92 D1001.3 | v8,22.29 8,21.72 4.57,18.29 4.46,18.29 4.34,18.17 4.23,18.17 3.89,17.83 2.63,17.83 JP1.7 | 23.95,10.34 25.38,8.91 25.38,8.12 v25.83,7.66 | 23.95,10.34 22.86,11.43 22.86,11.89 U902.19 | U1002.1 41.38,21.26 41.38,20.57 C1005.P$1 41.26,20.69 40.12,20.69 39.78,21.03 39.89,21.14 39.89,21.26 U1002.4 39.78,21.26 38.63,21.26 C1001.P$1 38.52,21.26 38.41,21.14 38.41,20.69 35.09,17.37 v34.86,17.37 34.86,17.26 33.95,16.34 v33.95,15.43 | v38.41,27.32 38.41,26.4 30.86,18.86 v30.86,17.26 | v19.77,9.49 23.09,9.49 23.95,10.34
CAN_R  (via drill 0.61)
  Top 0.254: v15.43,32.35 14.74,33.03 U302.6 | v21.37,25.6 21.14,25.38 21.14,25.26 21.26,25.15 21.26,21.6 21.03,21.37 20.46,21.37 U801.32 | v23.2,24.8 23.2,24.46 27.43,20.23 27.43,18.97 30.06,16.34 35.09,16.34 36.69,17.95 44.46,17.95 46.41,19.89 46.52,19.89 46.86,20.23 48.23,20.23 JP2.3
  Bottom 0.254: v15.43,32.35 16.8,32.35 21.37,27.77 v21.37,25.6 21.49,25.6 22.29,24.8 v23.2,24.8
CAN_T  (via drill 0.61)
  Top 0.254: v16,30.18 15.6,30.57 | 15.6,30.57 14.29,31.89 14.29,32.12 13.72,32.69 13.72,33.03 U302.4 | v19.09,20.92 19.2,20.8 20.34,20.8 U801.33 | 15.6,30.57 v19.32,34.29
  Bottom 0.254: v16,30.18 17.72,30.18 18.63,29.26 18.63,28 19.89,26.75 19.89,21.72 v19.09,20.92 | v19.32,34.29 22.75,37.72 38.41,37.72 45.38,30.75 45.38,19.2 46.29,18.29 46.41,18.29 46.86,17.83 48.23,17.83 JP2.2
CON_SELECT0  (via drill 0.61)  (1 unrouted)
  Top 0.254: v37.83,15.43 38.41,14.86 38.41,14.52 R712.P$1 | v40.12,19.2 46.29,25.38 v46.29,26.29
  Bottom 0.254: v37.83,15.43 37.83,16.92 v40.12,19.2 | v46.29,26.29 45.83,26.75 45.83,31.09 38.75,38.18 8.46,38.18 3.31,33.03 2.63,33.03 JP1.1
CON_SELECT1  (via drill 0.61)
  Top 0.254: v40.46,17.03 39.78,16.34 39.66,16.34 R709.P$1 | v44.46,30.4 44.46,32.69 40.35,36.8 v37.95,36.8 | v28.12,20.8 29.38,20.8 U801.4 | v24.69,20.69 22.52,18.52 21.95,18.52 21.14,17.72 20.23,17.72 v19.55,17.03 | v17.6,18.97 16.69,18.97 14.74,20.92 5.94,20.92 v5.49,20.46
  Bottom 0.254: v40.46,17.03 44.92,21.49 44.92,29.95 v44.46,30.4 | v37.95,36.8 24.46,36.8 24.35,36.92 23.32,36.92 19.77,33.38 18.97,33.38 18.63,33.72 7.32,33.72 5.09,31.49 | 5.09,31.49 4.57,30.98 4.34,30.98 3.89,30.52 2.63,30.52 JP1.2 | v28.12,20.8 24.8,20.8 v24.69,20.69 | v17.6,18.97 v19.55,17.03 | v5.49,20.46 5.49,31.09 5.09,31.49
CS2  (1 unrouted)
GND  (29 unrouted)
  Top 0.254: U801.35 20.46,19.89 21.26,19.89 21.41,19.81 | U801.23 22.63,26.63 22.63,27.43 22.68,27.61 | U801.8 29.38,22.86 28.57,22.86 28.38,22.88
  Bottom 0.254: L901.P$4 14.29,19.66 14.29,19.55 14.22,19.4 | L901.P$3 14.29,20.46 14.29,20.12 L901.P$5 | 13.72,23.32 13.95,23.32 U1001.6 | U1002.GND 40.58,22.17 39.43,22.17 39.33,22.23
  pour Bottom (isolate 0.406, no thermals): 0,41.91 50.8,41.91 50.8,0 0,0
  pour Top (isolate 0.406, no thermals): 50.8,0 0,0 0,41.91 50.8,41.91
IN_CH1
  Top 0.254: U1.1 40.92,27.66 42.06,26.52 42.06,26.4 40.58,24.92 35.09,24.92 34.18,25.83 32.12,25.83 30.18,23.89 29.49,23.89 U801.10
IN_CH2  (1 unrouted)
IN_CH3  (1 unrouted)
IN_CH4
  Top 0.254: U1.5 41.95,29.72 42.52,29.72 44.01,31.2 44.01,32.46 41.49,34.98 34.4,34.98 29.15,29.72 29.15,27.2 28.69,26.75 28,26.75 27.89,26.63 27.66,26.63 U801.13
IN_CH5  (1 unrouted)
IN_CH6  (via drill 0.61)
  Top 0.254: v40.69,30.18 41.26,30.75 41.83,30.75 U1.7 | v30.06,31.89 26.86,31.89 25.15,30.18 25.15,29.95 25.6,29.49 25.6,28 25.72,27.89 25.72,27.32 25.6,27.2 25.6,26.63 U801.17
  Bottom 0.254: v40.69,30.18 31.77,30.18 v30.06,31.89
IN_CH7  (via drill 0.61)
  Top 0.254: R909.P$1 23.77,9.14 23.77,10.52 24,10.74 24,10.86 23.89,10.97 D901.C 23.89,11.09 23.77,11.09 23.66,10.97 22.52,12.12 v20.69,12.12 | v43.09,31.55 42.75,31.2 41.95,31.2 U1.8 | 19.95,27.95 18.52,26.52 18.52,23.77 19.43,22.86 20.34,22.86 U801.29 | 19.95,27.95 v26.29,34.29 | 19.95,27.95 v19.66,28.23
  Bottom 0.254: U903.2 13.72,12 13.72,12.34 14.63,13.26 14.86,13.26 14.97,13.14 15.09,13.14 15.89,12.34 20.46,12.34 v20.69,12.12 20.46,12.46 20.46,27.43 v19.66,28.23 | v43.09,31.55 42.06,31.55 37.72,35.89 30.86,35.89 30.75,36.01 28,36.01 v26.29,34.29
IO-!RESET  (2 unrouted)
  Top 0.254: C801.P$2 30.75,22.63 31.43,23.32 32.12,23.32 32.35,23.55 32.58,23.55 32.69,23.43 S801.A1 32.69,23.55 33.6,24.46 33.72,24.46 34.29,25.03 34.86,24.46 40.92,24.46 45.38,28.92 45.38,31.43 46.86,32.92 48.23,32.92 JP2.8
IO-!VDD_SERVO_IN_FAULT  (via drill 0.61)
  Top 0.254: v12.23,20 10.4,20 7.89,17.49 7.89,10.74 8.69,9.94 15.77,9.94 22.63,16.8 22.63,17.49 U801.38
  Bottom 0.254: v12.23,20 13.49,21.26 13.49,21.37 U1001.4
IO-BOOT0  (1 unrouted)
IO-BOOT1
  Top 0.254: R802.P$1 23.89,27.89 23.89,27.55 24.12,27.32 24.12,26.63 U801.20
IO-CH8-PROT
  Bottom 0.254: R905.P$2 2.52,7.77 2.52,6.4 U$1.1
IO-CH8-PROT1
  Bottom 0.254: R1.P$2 30.52,7.77 30.52,6.4 U$2.1
IO-SWCLK
  Top 0.254: U801.37 22.06,17.49 21.6,17.49 21.37,17.26 20.69,17.26 20.46,17.03 20.46,16.12 15.32,10.97 14.06,10.97 13.49,11.54 13.49,12.69 JX802.4
IO-SWDIO  (1 unrouted)
IO-USART1_RX
  Top 0.254: 18.75,21.83 20.34,21.83 U801.31 | 18.75,21.83 18.29,21.37 5.49,21.37 4.46,22.4 4.34,22.4 3.89,22.86 JP1.5 | J801.P$3 32.69,37.38 32.69,38.41 30.75,40.35 30.06,40.35 28.8,39.09 28.8,37.95 27.55,36.69 26.86,36.69 18.06,27.89 18.06,23.09 18.52,22.63 18.52,21.95 18.63,21.83 18.75,21.83
IO-USART1_TX  (1 unrouted)
IO-VDD_3V3  (via drill 0.61)  (3 unrouted)
  Top 0.254: C901.P$1 13.49,29.72 13.49,29.03 C804.P$1 13.49,28.92 13.49,28.23 C802.P$1 13.49,28.12 13.49,27.43 C803.P$1 13.49,27.32 16.34,24.46 v16.34,22.29 | C1.P$1 40.69,33.26 40.69,32.8 40.8,32.69 40.8,32.23 U1.10 40.8,32.12 40.8,32 v40.12,31.32 | v42.63,27.43 41.95,28.12 U1.2 | 29.03,15.43 29.03,15.09 v28.46,14.52 | 29.03,15.43 29.03,16.69 28.35,17.37 28.23,17.37 28.12,17.49 28,17.49 27.89,17.6 27.66,17.6 U801.48 | 20.34,19.09 20.34,18.75 19.55,17.95 16.69,17.95 | 20.34,19.09 20.34,19.32 U801.36 | 16.69,17.95 16.46,17.95 15.66,17.14 14.97,17.14 14.63,16.8 JX802.1 | v22.17,19.43 22.06,19.32 21.95,19.32 21.72,19.09 21.6,19.09 21.37,19.32 21.26,19.32 21.03,19.09 20.34,19.09 | 29.03,15.43 v32.69,15.43 | v16.69,18.06 16.69,17.95
  Bottom 0.254: 14.86,15.43 14.52,15.43 U903.8 | 14.86,15.43 16.12,15.43 16.46,15.09 16.69,15.09 R9.P$2 | v16.34,22.29 16.69,21.95 v16.69,18.06 16.69,17.37 14.86,15.54 14.86,15.43 | 42.63,26.4 v42.63,27.43 42.63,29.49 40.8,31.32 v40.12,31.32 | 42.63,26.4 43.55,25.49 43.55,25.38 43.2,25.03 43.2,24.92 42.86,24.57 42.75,24.57 42.29,24.12 42.29,24 42.41,23.89 C1004.P$1 42.29,23.89 C1003.P$1 | 24.12,19.2 24.12,17.26 22.86,16 22.86,15.54 U902.2 | 24.12,19.2 24.69,19.77 25.38,19.77 27.66,17.49 27.66,16.57 26.86,15.77 26.86,14.86 26.63,14.63 26.86,14.4 U902.10 26.98,14.4 27.09,14.29 27.43,14.29 C903.P$1 27.55,14.29 28,14.29 28.12,14.4 28.35,14.4 v28.46,14.52 | 24.12,19.2 22.4,19.2 v22.17,19.43 | 42.63,26.4 39.09,26.4 32.69,20 v32.69,15.43
IO-VDD_5V5
  Top 0.254: LED705.A 38.41,11.2 39.55,11.2 LED703.A 39.66,11.2 40.8,11.2 LED702.A
MISO2  (via drill 0.61)
  Top 0.254: v40.46,37.72 37.6,37.72 36.58,36.69 35.43,36.69 32.12,33.38 26.06,33.38 20.34,27.66 20.34,25.95 19.55,25.15 19.55,24 19.66,23.89 20.34,23.89 U801.27
  Bottom 0.254: v40.46,37.72 40.46,37.15 46.29,31.32 46.29,29.95 46.98,29.26 46.98,29.03 46.41,28.46 46.41,27.43 48.35,25.49 JP2.5
MOSI2  (1 unrouted)
N$1
  Bottom 0.254: U1001.8 15.09,23.32 15.77,24 16.23,24 16.34,24.12 16.57,24.12 17.14,24.69 17.26,24.69 17.49,24.92 17.95,24.46 17.95,24 D1001.2
N$2  (via drill 0.61)
  Top 0.254: v28.8,6.51 29.15,6.17 29.15,5.83 29.83,5.14 29.83,5.03 29.03,4.23 29.03,3.89 v28.69,3.54 | v22.86,8.57 22.52,8.91 22.52,10.06 22.17,10.4 v20.92,10.4 | v17.6,22.29 17.6,27.77 16.57,28.8 16.57,29.49 20.34,33.26 v21.6,33.26 | v33.49,32.8 33.49,30.86 36.58,27.77 36.58,27.55 37.95,26.18 38.52,26.18 39.32,26.98 39.32,27.66 U1.20
  Bottom 0.254: v28.8,6.51 29.83,7.54 29.83,8.34 30.29,8.8 30.4,8.8 R1.P$1 | v28.69,3.54 28,3.54 27.09,2.63 26.18,2.63 25.6,3.2 25.15,3.2 24.57,2.63 23.66,2.63 22.97,3.31 22.97,4.23 23.66,4.92 24.35,4.92 25.26,5.83 25.26,6.97 24.35,7.89 24.35,8 23.77,8.57 v22.86,8.57 | v20.92,10.4 18.63,10.4 18.52,10.52 15.66,10.52 14.4,9.26 13.37,9.26 13.03,9.6 12.23,9.6 10.86,10.97 10.86,15.2 11.43,15.77 11.66,15.77 13.49,17.6 14.86,17.6 14.97,17.49 15.77,18.29 15.77,18.4 16.23,18.86 16.23,20.46 15.66,21.03 15.66,21.72 15.43,21.95 15.43,22.63 16,23.2 16.69,23.2 v17.6,22.29 | v21.6,33.26 33.03,33.26 v33.49,32.8
N$3  (1 unrouted)
N$4  (1 unrouted)
N$5  (1 unrouted)
N$6  (1 unrouted)
N$7  (1 unrouted)
N$8  (via drill 0.61)
  Top 0.254: v42.29,9.6 41.83,9.6 40.92,8.69 29.49,8.69 28.46,7.66 28.46,7.54 27.77,6.86 27.77,5.6 27.32,5.14 27.32,4.8 27.77,4.34 27.77,3.31 27.09,2.63 26.29,2.63 25.49,3.43 25.49,4 24.23,5.26 23.43,5.26 v22.52,6.17 | v19.66,8.23 18.86,9.03 7.66,9.03 v6.51,10.17 | v20.69,32.35 v17.49,29.15 | v39.55,29.26 39.2,29.6 39.2,30.52 38.98,30.75 38.41,30.75 U1.14
  Bottom 0.254: v42.29,9.6 42.98,8.91 43.09,8.91 R6.P$1 | v22.52,6.17 21.03,7.66 20.23,7.66 v19.66,8.23 | v6.51,10.17 6.51,12.34 8.46,14.29 8.46,20.8 9.37,21.72 9.37,23.43 9.83,23.89 9.83,24.8 14.17,29.15 v17.49,29.15 | v20.69,32.35 28.35,32.35 31.09,29.6 39.2,29.6 v39.55,29.26
N$9
  Top 0.254: R712.P$2 38.41,13.37 38.41,12.8 LED705.C
N$10  (via drill 0.61)
  Top 0.254: v37.15,28.69 37.6,29.15 37.6,31.09 37.72,31.2 38.29,31.2 U1.13
  Bottom 0.254: v37.15,28.69 29.95,21.49 29.95,16.92 32.35,14.52 40.12,14.52 45.72,8.91 R7.P$1
N$12
  Bottom 0.254: R3.P$2 35.55,7.77 35.55,6.4 U$2.7
N$13
  Bottom 0.254: R4.P$2 38.06,7.77 38.06,6.4 U$2.10
N$14
  Bottom 0.254: R5.P$2 40.69,7.77 40.69,6.4 U$2.13
N$15
  Bottom 0.254: R6.P$2 43.2,7.77 43.2,6.4 U$2.16
N$16
  Bottom 0.254: U$2.19 R7.P$2
N$17
  Bottom 0.254: R2.P$2 33.03,7.77 33.03,6.4 U$2.4
N$18
  Top 0.254: C806.P$2 35.2,21.03 33.83,21.03 33.72,20.92 X801.1 33.49,20.92 33.26,20.92 32.23,21.95 30.4,21.95 30.29,21.83 29.49,21.83 U801.6
N$19
  Bottom 0.254: U1001.1 14.97,21.37 14.97,21.03 14.86,20.92 14.86,20.8 14.97,20.69 14.97,20.12 L901.P$2
N$20  (1 unrouted)
N$22  (1 unrouted)
  Top 0.254: C805.P$1 35.2,18.97 33.49,17.26 32.12,17.26 31.43,17.95 31.43,19.2 X801.3
N$29
  Top 0.254: R708.P$2 40.92,13.37 40.92,12.8 LED702.C
N$31
  Bottom 0.254: R914.P$2 5.14,7.77 5.14,6.4 U$1.4
N$38  (via drill 0.61)  (1 unrouted)
  Top 0.254: v26.75,29.95 26.75,29.6 26.52,29.38 26.52,29.03 R901.P$2
  Bottom 0.254: v26.75,29.95 26.75,25.6 29.49,22.86 29.49,11.77 28.23,10.52 28.12,10.63 D902.C 28.23,10.4 28.23,9.72 R910.P$1
N$39
  Top 0.254: R736.P$1 39.66,14.52 39.66,15.2 R709.P$2
N$40
  Top 0.254: R736.P$2 39.66,13.37 39.66,12.8 LED703.C
N$43  (via drill 0.61)
  Top 0.254: v28.12,15.77 26.4,14.06 26.06,14.06 25.38,13.37 24.23,13.37 24,13.14 v23.89,13.14
  Bottom 0.254: v28.12,15.77 29.03,16.69 29.03,22.63 18.4,33.26 15.09,33.26 8.91,27.09 8.91,21.95 8,21.03 8,14.52 2.63,9.14 2.63,8.91 R905.P$1 | v23.89,13.14 23.55,12.8 22.63,12.8 22.4,13.03 U902.20
N$44  (1 unrouted)
N$45  (1 unrouted)
N$46
  Bottom 0.254: D1001.1 18.06,25.95 18.06,27.32 17.72,27.66 13.37,27.66 11.43,25.72 11.43,24.57 11.2,24.35 F1001.2
N$49  (1 unrouted)
N$53  (1 unrouted)
N$58  (1 unrouted)
N$59  (1 unrouted)
N$71
  Bottom 0.254: R906.P$2 7.66,7.77 7.66,6.4 U$1.7
N$72
  Bottom 0.254: R915.P$2 10.17,7.77 10.17,6.4 U$1.10
N$73
  Bottom 0.254: R907.P$2 12.69,7.77 12.69,6.4 U$1.13
N$74
  Bottom 0.254: R916.P$2 15.2,7.77 15.2,6.4 U$1.16
N$75
  Bottom 0.254: R908.P$2 17.83,7.77 17.83,6.4 U$1.19
N$99
  Bottom 0.254: R910.P$2 27.2,9.6 27.2,9.49 27.77,8.91 27.77,8.34 28,8.12 28,8 26.98,6.97 26.98,6.63 26.75,6.4 JP3.1
N$104  (1 unrouted)
N$110
  Bottom 0.254: D904.CATHODE 10.97,18.29 11.2,18.06 11.89,18.06 12,17.95 12.57,17.95 12.92,18.29 D903.C 13.49,18.4 13.49,18.52 13.14,18.86 13.14,19.32 13.37,19.55 13.37,20 L901.P$1
OTG_DM1
  Top 0.254: U302.1 14.74,34.52 14.74,34.63 14.97,34.86 14.97,35.55 14.63,35.89 14.63,36.8 J301.D-
OTG_DP1
  Top 0.254: U302.3 13.72,34.52 13.72,34.86 14.17,35.32 14.17,35.66 13.95,35.89 13.95,36.8 J301.D+
OUT_CH1  (via drill 0.61)
  Top 0.254: v25.03,25.38 25.15,25.49 25.15,26.52 U801.18
  Bottom 0.254: v25.03,25.38 21.14,21.49 21.14,15.66 22.29,14.52 U902.1
OUT_CH2  (1 unrouted)
OUT_CH3  (1 unrouted)
OUT_CH4  (1 unrouted)
OUT_CH5  (via drill 0.61)
  Top 0.254: v25.03,18.86 25.15,18.75 U801.43
  Bottom 0.254: v25.03,18.86 24.92,18.75 24.92,15.54 U902.6
OUT_CH6  (via drill 0.61)
  Top 0.254: v25.03,14.29 25.03,14.97 26.18,16.12 26.18,17.49 U801.45
  Bottom 0.254: v25.03,14.29 25.03,14.52 25.38,14.86 25.38,15.43 U902.7
OUT_CH7  (1 unrouted)
PPM-SBUS-PROT
  Top 0.254: R909.P$2 23.89,8.12 23.89,7.77 24,7.66 24,6.51 24.12,6.4 JP3.2
RSSI_IN
  Top 0.254: R901.P$1 26.52,27.89 26.52,27.32 26.63,27.2 26.63,26.63 U801.15
SBUS_INPUT  (via drill 0.61)
  Top 0.254: v18.75,11.43 22.97,15.66 23.2,15.66 23.66,16.12 23.66,16.23 24.12,16.69 24.12,17.49 U801.41
  Bottom 0.254: v18.75,11.43 15.89,11.43 14.74,10.29 14.52,10.29 14.4,10.4 14.17,10.4 13.83,10.06 12.69,10.06 12.57,10.17 12.34,10.17 11.54,10.97 11.54,12.92 12.23,13.6 12.23,14.06 13.03,14.86 13.03,15.43 U903.6
SBUS_OUTPUT  (1 unrouted)
SCK2  (1 unrouted)
SCL2  (1 unrouted)
SDA2  (1 unrouted)
VBUS  (1 unrouted)
VDD_3V3_SPEKTRUM  (via drill 0.61)
  Top 0.254: D801.C 28,35.09 28,36.01 28.69,36.69 29.49,36.69 29.72,36.92 29.72,37.26 J801.P$1 29.6,36.69 29.6,35.89 v30.4,35.09
  Bottom 0.254: U1002.8 41.49,22.86 C1008.P$1 42.52,22.86 42.52,22.75 43.66,21.6 44.23,22.17 44.23,28.57 37.72,35.09 v30.4,35.09
VDD_3V3_SPEKTRUM_EN  (1 unrouted)
  Bottom 0.254: U1002.5 39.78,22.97 39.55,23.2 39.43,23.2 39.09,23.55 39.09,23.66 38.98,23.77 39.09,23.89 R1002.P$2
VDD_5V_IN
  Top 0.254: U$2.2 30.52,3.77 32.92,3.77 U$2.5 33.03,3.77 35.55,3.77 U$2.8 35.66,3.77 38.06,3.77 U$2.11 38.18,3.77 40.58,3.77 U$2.14 40.69,3.77 43.09,3.77 U$2.17 43.2,3.77 45.72,3.77 U$2.20 45.83,3.77 48.23,3.77 U$2.23 | 21.6,5.83 21.6,6.51 21.72,6.63 21.72,7.09 21.6,7.2 21.95,7.54 21.95,8.57 R922.P$2 | 21.6,5.83 20.34,4.57 20.34,3.89 U$1.23 20.23,3.77 17.83,3.77 U$1.20 17.72,3.77 15.32,3.77 U$1.17 15.2,3.77 12.8,3.77 U$1.14 | 21.6,5.83 23.55,3.89 24.12,3.89 JP3.4 | U$1.2 2.63,3.77 5.03,3.77 U$1.5 5.14,3.77 7.54,3.77 U$1.8 7.66,3.77 10.06,3.77 U$1.11
  Bottom 0.254: F1001.1 11.09,21.37 10.97,21.26 10.97,20.23 D904.ANODE 10.86,20.12 10.63,20.12 8.91,18.4 8.91,11.66 10.52,10.06 10.52,9.6 10.86,9.26 10.86,7.54 11.43,6.97 11.43,5.14 | 11.43,5.14 10.17,3.89 U$1.11 | 11.43,5.14 12.69,3.89 U$1.14 | U$2.2 30.4,3.89 29.6,3.89 27.89,5.6 27.77,5.6 27.43,5.26 25.6,5.26 24.23,3.89 JP3.4
VDD_SERVO_SENS  (via drill 0.61)  (1 unrouted)
  Top 0.254: v24.23,29.72 23.89,29.38 23.89,28.8 R919.P$2 | v28.23,28.92 27.2,27.89 R918.P$1
  Bottom 0.254: v24.23,29.72 25.26,29.72 26.4,30.86 27.09,30.86 28.23,29.72 v28.23,28.92